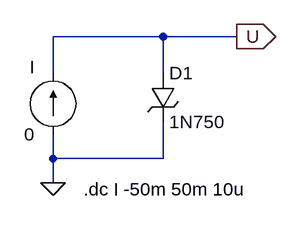
[diagram p0: schematic Diode_Zener.asc]
Diode_Zener.asc, the LTspice schematic file:
Version 4
SHEET 1 880 680
WIRE 128 48 -16 48
WIRE 224 48 128 48
WIRE -16 96 -16 48
WIRE 128 96 128 48
WIRE -16 208 -16 176
WIRE 128 208 128 160
WIRE 128 208 -16 208
WIRE -16 240 -16 208
FLAG -16 240 0
FLAG 224 48 U
IOPIN 224 48 Out
SYMBOL zener 112 96 R0
SYMATTR InstName D1
SYMATTR Value 1N750
SYMBOL current -16 176 R180
WINDOW 0 24 88 Left 2
WINDOW 3 24 0 Left 2
WINDOW 123 0 0 Left 0
WINDOW 39 0 0 Left 0
SYMATTR InstName I
SYMATTR Value 0
TEXT 24 248 Left 2 !.dc I -50m 50m 10u

The netlist it stands for:
* Diode_Zener.asc
D1 U 0 1N750
I 0 U 0
.model D D
.lib standard.dio
.dc I -50m 50m 10u
.backanno
.end